# Altium schematic sheet Port.SchDoc
size A4; SheetNumber: 3; SheetTotal: 4
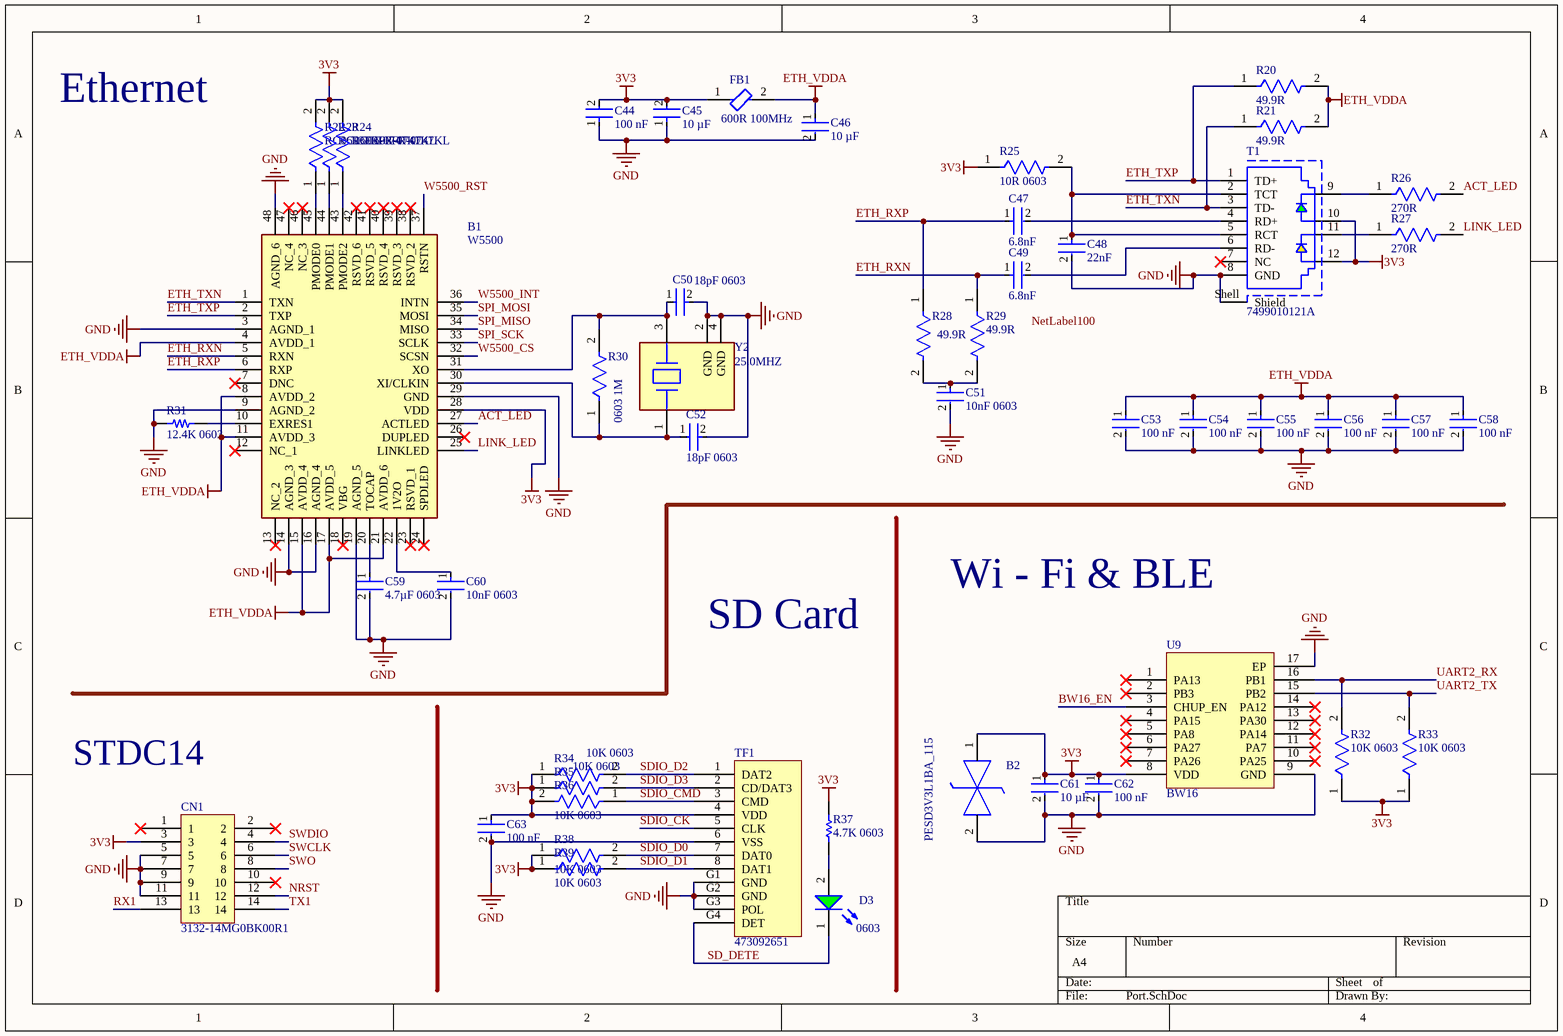
[diagram p0: Port.SchDoc]

## Parts
B1  W5500  [W5500]
B2  PESD3V3L1BA_115  [SOD2512X110N]
C44  100 nF  [FP-CL10-IPC_A]
C45  10 µF  [FP-CL10-IPC_C]
C46  10 µF  [FP-CL10-IPC_C]
C47  6.8nF  [FP-CC0603-DA-MFG]
C48  22nF  [FP-CC0603-DA-MFG]
C49  6.8nF  [FP-CC0603-DA-MFG]
C50  18pF 0603  [FP-C1608-080-0_1-IPC_C]
C51  10nF 0603  [FP-CC0603-DA-MFG]
C52  18pF 0603  [FP-C1608-080-0_1-IPC_C]
C53  100 nF  [FP-CL10-IPC_A]
C54  100 nF  [FP-CL10-IPC_A]
C55  100 nF  [FP-CL10-IPC_A]
C56  100 nF  [FP-CL10-IPC_A]
C57  100 nF  [FP-CL10-IPC_A]
C58  100 nF  [FP-CL10-IPC_A]
C59  4.7µF 0603  [FP-C0603-CG-MFG]
C60  10nF 0603  [FP-CC0603-DA-MFG]
C61  10 µF  [FP-CL10-IPC_C]
C62  100 nF  [FP-CL10-IPC_A]
C63  100 nF  [FP-CL10-IPC_A]
CN1  3132-14MG0BK00R1  [STDC14 Header]
D3  0603  [WL-SMCW_0603_150060xx75000]
FB1  600R 100MHz  [FP-BLM18-0_15-t0_8-MFG]
R20  49.9R  [FP-RT0603-MFG]
R21  49.9R  [FP-RT0603-MFG]
R22  RC0603FR-0747KL  [FP-RC0603FR-0747KL-MFG]
R23  RC0603FR-0747KL  [FP-RC0603FR-0747KL-MFG]
R24  RC0603FR-0747KL  [FP-RC0603FR-0747KL-MFG]
R25  10R 0603  [FP-RT0603-MFG]
R26  270R  [FP-RT0603-MFG]
R27  270R  [FP-RT0603-MFG]
R28  49.9R  [FP-RT0603-MFG]
R29  49.9R  [FP-RT0603-MFG]
R30  0603 1M  [FP-RC0603-0_55-IPC_C]
R31  12.4K 0603  [4.7R]
R32  10K 0603  [FP-RC0603-0_55-IPC_C]
R33  10K 0603  [FP-RC0603-0_55-IPC_C]
R34  10K 0603  [FP-RC0603-0_55-IPC_C]
R35  10K 0603  [FP-RC0603-0_55-IPC_C]
R36  10K 0603  [FP-RC0603-0_55-IPC_C]
R37  4.7K 0603  [RESC1608X55X25LL10T15]
R38  10K 0603  [FP-RC0603-0_55-IPC_C]
R39  10K 0603  [FP-RC0603-0_55-IPC_C]
T1  7499010121A  [7499010121A]
TF1  473092651  [TF-SMD_47309-2285]
U9  BW16  [BW16]
Y2  25.0MHZ  [FP-ABM8G-MFG]

## Nets
3V3: B1.28(VDD) B2.1(K1) C44.2 C45.2 C61.1 C62.1 C63.1 CN1.3 FB1.1 R22.2 R23.2 R24.2 R25.1 R32.1 R33.1 R34.1 R35.1 R36.2 R37.1 R38.1 R39.1 T1.10 T1.12 TF1.4(VDD) U9.8(VDD)
ETH_VDDA: B1.4(AVDD_1) B1.8(AVDD_2) B1.11(AVDD_3) B1.15(AVDD_4) B1.17(AVDD_5) B1.21(AVDD_6) C46.1 C53.1 C54.1 C55.1 C56.1 C57.1 C58.1 FB1.2 R20.2 R21.2
GND: B1.3(AGND_1) B1.9(AGND_2) B1.14(AGND_3) B1.16(AGND_4) B1.19(AGND_5) B1.29(GND) B1.48(AGND_6) B2.2(K2) C44.1 C45.1 C46.2 C48.2 C50.2 C51.2 C52.2 C53.2 C54.2 C55.2 C56.2 C57.2 C58.2 C59.2 C60.2 C61.2 C62.2 C63.2 CN1.5 CN1.7 CN1.9 CN1.11 R31.2 T1.8(GND) T1.Shell(Shield) TF1.6(VSS) TF1.G1(GND) TF1.G2(GND) TF1.G3(POL) U9.9(GND) U9.17(EP) Y2.2(GND) Y2.4(GND)
ACT_LED: B1.27(ACTLED) R26.2
BW16_EN: U9.3(CHUP_EN)
ETH_RXN: B1.5(RXN) C49.1 R29.1
ETH_RXP: B1.6(RXP) C47.1 R28.1
ETH_TXN: B1.1(TXN) R21.1 T1.3(TD-)
ETH_TXP: B1.2(TXP) R20.1 T1.1(TD+)
LINK_LED: B1.25(LINKLED) R27.2
NRST: CN1.12
RX1: CN1.13
SD_DETE: D3.1(K) TF1.G4(DET)
SDIO_CK: TF1.5(CLK)
SDIO_CMD: R36.1 TF1.3(CMD)
SDIO_D0: R38.2 TF1.7(DAT0)
SDIO_D1: R39.2 TF1.8(DAT1)
SDIO_D2: R34.2 TF1.1(DAT2)
SDIO_D3: R35.2 TF1.2(CD/DAT3)
SPI_MISO: B1.34(MISO)
SPI_MOSI: B1.35(MOSI)
SPI_SCK: B1.33(SCLK)
SWCLK: CN1.6
SWDIO: CN1.4
SWO: CN1.8
TX1: CN1.14
UART2_RX: R32.2 U9.16(PB1)
UART2_TX: R33.2 U9.15(PB2)
W5500_CS: B1.32(SCSN)
W5500_INT: B1.36(INTN)
W5500_RST: B1.37(RSTN)
NetB1_10: B1.10(EXRES1) R31.1
NetB1_20: B1.20(TOCAP) C59.1
NetB1_22: B1.22(1V2O) C60.1
NetB1_30: B1.30(XI/CLKIN) C52.1 R30.1 Y2.1
NetB1_31: B1.31(XO) C50.1 R30.2 Y2.3
NetB1_43: B1.43(PMODE2) R24.1
NetB1_44: B1.44(PMODE1) R23.1
NetB1_45: B1.45(PMODE0) R22.1
NetC47_2: C47.2 T1.4(RD+)
NetC48_1: C48.1 R25.2 T1.2(TCT) T1.5(RCT)
NetC49_2: C49.2 T1.6(RD-)
NetC51_1: C51.1 R28.2 R29.2
NetD3_2: D3.2(A) R37.2
NetR26_1: R26.1 T1.9
NetR27_1: R27.1 T1.11

Not connected (* = marked no-connect by the designer): B1 7(DNC)* 12(NC_1)* 13(NC_2)* 18(VBG)* 23(RSVD_1)* 24(SPDLED)* 26(DUPLED)* 38(RSVD_2)* 39(RSVD_3)* 40(RSVD_4)* 41(RSVD_5)* 42(RSVD_6)* 46(NC_3)* 47(NC_4)*; CN1 1* 2* 10*; T1 7(NC)*; U9 1(PA13)* 2(PB3)* 4(PA15)* 5(PA8)* 6(PA27)* 7(PA26)* 10(PA25)* 11(PA7)* 12(PA14)* 13(PA30)* 14(PA12)*

## Notes on the sheet
- Ethernet
- SD Card
- Wi - Fi & BLE
- STDC14
- Labels drawn without touching a wire or pin: NetLabel100

## Library data of the parts
B1 = W5500: Ethernet ICs 3in1 Enet Controller TCP/IP +MAC+PHY; Manufacturer_Name: WIZnet Inc; Geometry.Height: 1.6mm; Manufacturer_Part_Number: W5500; Mouser Part Number: 950-W5500; Mouser Price/Stock: https://www.mouser.co.uk/ProductDetail/WIZnet/W5500?qs=2vh%252B45pPFtzthUpYPd4pqA%3D%3D; Arrow Part Number: *; Arrow Price/Stock: *; Datasheet Link: http://wizwiki.net/wiki/lib/exe/fetch.php?media=products:w5500:w5500_ds_v106e_141230.pdf
B2 = PESD3V3L1BA_115: PESD3V3L1BA - Low capacitance bidirectional ESD protection diode in SOD323; Manufacturer_Name: Nexperia; Manufacturer_Part_Number: PESD3V3L1BA,115; Geometry.Height: 1.1mm; Mouser Part Number: 771-PESD3V3L1BA-T/R; Mouser Price/Stock: https://www.mouser.co.uk/ProductDetail/Nexperia/PESD3V3L1BA115?qs=LOCUfHb8d9tfcQwAsqvzKg%3D%3D; Arrow Part Number: PESD3V3L1BA,115; Arrow Price/Stock: https://www.arrow.com/en/products/pesd3v3l1ba115/nexperia?region=nac; Datasheet Link: https://assets.nexperia.com/documents/data-sheet/PESDXL1BA_SER.pdf
C44 C53-C58 C62 C63 = CMP-13271-004036-1: Cap Ceramic 100nF 100V X7R ±10% Pad SMD 0603 +125°C T/R; Mount: Surface Mount; Packaging: Cut Tape; Width: 0.031inch; Thickness: 0.035inch; Length: 0.063inch; Tolerance: 10%; Min Operating Temperature: -55°C; Case/Package: 0603; Voltage Rating: 100V; Max Operating Temperature: 125°C; Case Code (Metric): 1608; Capacitance: 100nF; Case Code (Imperial): 0603
C45 C46 C61 = CMP-13271-004224-1: Cap Ceramic 10uF 25V X5R ±20% Pad SMD 0603 +85°C T/R; Width: 0.031inch; Voltage Rating: 25V; Length: 0.063inch; Case Code (Metric): 1608; Dielectric: X5R; Termination: Wraparound; Capacitance: 10uF; Lead Free: Lead Free; Mount: Surface Mount; Package Quantity: 1; Case Code (Imperial): 0603; Thickness: 0.035inch; Packaging: Tape and Reel; Contact Plating: Tin; Min Operating Temperature: -55°C; Tolerance: 20%; Max Operating Temperature: 85°C; Case/Package: 0603
C47 C49 = CMP-03422-000576-1: CAP CER 6800PF 50V X7R 0603; Manufacturer Part Number: CC0603KRX7R9BB682; Manufacturer: YAGEO; Temperature Coefficient: 15%; Tolerance: 0.1; Material: Ceramic; Digikey Description: CAP CER 6800PF 50V X7R 0603; Footprint Url: http://www.yageo.com/exep/pages/download/literatures/UPY-C_GEN_24.pdf; Automotive: No; Octopart: https://octopart.com/cc0603krx7r9bb682-yageo-39467723; Lead Free: Yes; Temperature: -55°C to +125°C; RoHS: TRUE; Temperature Range High: +125°C; Package: CC0603-DA; Value: 6.8 nF; Height: 0.9mm; Temperature Range Low: -55°C; ComponentLink2Description: Datasheet; Category: Cap; Device Class L1: Passive Components; Device Class L2: Capacitors; Voltage: 50 V; Temperature Characteristic: X7R; Capacitance: 6.8 nF; Device Class L3: Ceramic Capacitors; Mouser Description: Multilayer Ceramic Capacitors MLCC - SMD/SMT 6.8nF 50V X7R 10%; Voltage Rating: 50 V; ComponentLink2URL: http://www.yageo.com/documents/recent/UPY-GPHC_X7R_6.3V-to-50V_18.pdf
C48 = CMP-2100-03602-3: CAP CER 0.022UF 50V X7R 0603; Dielectric Material: Ceramic; Insulation Resistance: 100GR; Tolerance: 10%; Thickness: 0.035inch; Case/Package: 0603; Packaging: Tape and Reel; Voltage Rating (DC): 50V; Length: 1.6mm; Depth: 0.8mm; Dielectric: X7R; Resistor Type: Ceramic; Min Operating Temperature: -55°C; Number of Pins: 2; Series: CC; Mount: Surface Mount; Max Operating Temperature: 125°C; Capacitance: 22nF; Case Code (Imperial): 0603; Width: 0.031inch; Halogen Free: Halogen Free; Lead Free: Lead Free; Voltage: 50V; RoHS Compliant: Yes; Package Quantity: 1; Height: 0.8mm; REACH SVHC: No SVHC; Voltage Rating: 50V; Case Code (Metric): 1608; Termination: SMD/SMT; Radiation Hardening: No
C50 C52 = CMP-08246-003585-1: Multilayer Ceramic Capacitors 18pF ±5% 50V C0G SMD 0603; Temperature Coefficient: 30ppm/°C; Height: 0.8mm; Packaging: Tape and Reel; Capacitance: 18pF; Min Operating Temperature: -55°C; Lead Free: Lead Free; Depth: 0.8mm; Length: 1.6mm; Voltage Rating: 50V; Weight: 7.1E-05oz; Radiation Hardening: No; Max Operating Temperature: 125°C; Voltage: 50V; Dielectric: C0G; Voltage Rating (DC): 50V; Case Code (Imperial): 0603; Number of Pins: 2; Mount: Surface Mount; Tolerance: 5%; Width: 0.031inch; RoHS Compliant: Yes; Series: C; Thickness: 0.037inch; Construction: Flat; Case Code (Metric): 1608; Case/Package: 0603; Package Quantity: 1; Dielectric Material: Ceramic; REACH SVHC: No SVHC; Termination: SMD/SMT
C51 C60 = CMP-2100-03600-2: CAP CER 10000PF 50V X7R 0603; Manufacturer Part Number: CC0603KRX7R9BB103; Manufacturer: YAGEO; Tolerance: 0.1; Material: Ceramic; Temperature Coefficient: 15%; Mouser Description: Multilayer Ceramic Capacitor, CC Series, 0.01 - F, - 10%, X7R, 50 V, 0603 [1608 Metric]; Digikey Description: CAP CER 10000PF 50V X7R 0603; Height: 0.9mm; Category: Cap; Temperature Characteristic: X7R; Footprint Url: http://www.yageo.com/exep/pages/download/literatures/UPY-C_GEN_24.pdf; Lead Free: Yes; Voltage Rating: 50 V; Temperature: -55°C to +125°C; Device Class L3: Ceramic Capacitors; ComponentLink2Description: Datasheet; Voltage: 50 V; Package: CC0603-DA; Octopart: https://octopart.com/cc0603krx7r9bb103-yageo-192938; Automotive: No; Temperature Range High: +125°C; Temperature Range Low: -55°C; Value: 10 nF; RoHS: TRUE; Device Class L1: Passive Components; ComponentLink2URL: http://www.yageo.com/documents/recent/UPY-GPHC_X7R_6.3V-to-50V_18.pdf; Device Class L2: Capacitors; Capacitance: 10 nF
C59 = CMP-2006-02256-2: CAP CER 4.7UF 6.3V X5R 0603; Manufacturer: Kemet; Manufacturer Part Number: C0603C475K9PACTU; Temperature Coefficient: 15%; Tolerance: 10%; Material: Ceramic; Device Class L3: Ceramic Capacitors; RoHS: TRUE; Value: 4.7uF; Lead Free: Yes; ComponentLink2Description: Datasheet; Mouser Description: Multilayer Ceramic Capacitors MLCC - SMD/SMT 6.3volts 4.7uF X5R 10%; Package: C0603-CG; Digikey Description: CAP CER 4.7UF 6.3V X5R 0603; ComponentLink2URL: https://content.kemet.com/datasheets/KEM_C1006_X5R_SMD.pdf; Category: Cap; Temperature Range Low: -55°C; Capacitance: 4.7uF; Temperature: -55°C to +85°C; Octopart: https://octopart.com/c0603c475k9pactu-kemet-104242; Ipc Land Pattern Name: CAPC16080X80; Voltage Rating: 6.3V; Temperature Range High: +85°C; Height: 0.9mm; Temperature Characteristic: X5R; Device Class L1: Passive Components; Automotive: No; Device Class L2: Capacitors
CN1 = STDC-14
D3 = CMP-1426-00002-3: NexarPartId: 29687084; Color: Green; Power Dissipation: 105mW; Peak Wavelength: 515nm; Viewing Angle: 140°; Test Current: 20mA; Wavelength: 520nm; Lens Style: Clear, Rectangular; Max Junction Temperature (Tj): 95°C; Luminous Intensity: 430mcd; Output Current: 10µA; Max Reverse Voltage (DC): 5V; Forward Voltage: 3.2V; Dominant Wavelength: 525nm; Forward Current: 100mA; Mount: Surface Mount; Height: 700µm; Lead Free: Lead Free; Min Operating Temperature: -40°C; Max Operating Temperature: 85°C; Length: 1.6mm; Width: 800µm; Case/Package: 0603; Case Code (Imperial): 0603; Case Code (Metric): 1608; Packaging: Tape and Reel; Reverse Voltage: 5V; REACH SVHC: Unknown; RoHS: Compliant
FB1 = CMP-0686-00436-3: Chip Ferrite Bead, 0603, 600Ω @ 100MHz, 0.38Ω, 25%, 500mA; Number of Lines: 1; DC Resistance (DCR): 380mR; Material: Steel; Shielding: Unshielded; Max DC Current: 500mA; Termination: SMD/SMT; Military Standard: Not; Number of Circuits: 1; Min Operating Temperature: -55°C; Case Code (Imperial): 0603; Width: 0.8mm; Current Rating: 500mA; Lead Free: Lead Free; Packaging: Tape and Reel; Frequency: 100MHz; Max Operating Temperature: 125°C; DC Current: 500mA; REACH SVHC: No SVHC; Case/Package: 0603; Package Quantity: 1; Height: 0.8mm; Number of Pins: 2; Impedance: 600R; Depth: 0.8mm; Test Frequency: 100MHz; Case Code (Metric): 1608; Tolerance: 25%; Core Material: Ferrite; Weight: 7.1E-05oz; Max Current Rating: 500mA; Radiation Hardening: No; Length: 1.6mm; RoHS Compliant: Yes
R20 R21 R28 R29 = CMP-03412-034007-1: RES SMD 49.9OHM 0.05% 1/10W 0603; Manufacturer: Yageo; Manufacturer Part Number: RT0603WRE0749R9L; Voltage Rating: 75V; Tolerance: 0.0005; Power Rating: 0.1W; Resistance: 49.9Ω; Temperature Coefficient: 50 ppm/°C; Value: 49.9Ω; RoHS: TRUE; Temperature Range Low: -55°C; Device Class L2: Resistors; Device Class L1: Passive Components; Footprint Url: http://www.yageo.com/exep/pages/download/literatures/PYu-R_Mount_10.pdf; Series: RT; Category: Res; Lead Free: Yes; Temperature: -55°C to +155°C; Octopart: https://octopart.com/rt0603wre0749r9l-yageo-71397127; Device Class L3: Chip SMD Resistors; Height: 0.55mm; Digikey Description: RES SMD 49.9OHM 0.05% 1/10W 0603; ComponentLink2Description: Datasheet; ComponentLink2URL: http://www.yageo.com/documents/recent/PYu-RT_1-to-0.01_RoHS_L_9.pdf; Automotive: No; Package: RT0603; Composition: Thin Film; Ipc Land Pattern Name: RESC16080X45; Temperature Range High: +155°C
R22-R24 = CMP-1659-00055-2: RES SMD 47K OHM 1% 1/10W 0603; Voltage Rating: 50V; Temperature Coefficient: 100ppm/°C; Max Power Dissipation: 100mW; Resistance: 47kR; Voltage Rating (DC): 50V; Min Operating Temperature: -55°C; Packaging: Tape and Reel; Features: Moisture Resistant; Termination: SMD/SMT; Technology: THICK FILM; Lead Free: Lead Free; Max Operating Temperature: 155°C; Width: 0.031inch; Case Code (Metric): 1608; Tolerance: 1%; Package Quantity: 1; Resistor Type: Thick Film; RoHS Compliant: Yes; Case/Package: 0603; Case Code (Imperial): 0603; Resistance Tolerance: 1%; Length: 0.063inch; Series: RC; Number of Pins: 2; Power Rating: 100mW; Number of Terminations: 2; Construction: Rectangular; Height: 0.022inch; Military Standard: Not; Size Code: 0603; Depth: 0.8mm
R25 = CMP-2000-04609-2: RES SMD 10 OHM 0.5% 1/10W 0603; Manufacturer: Yageo; Manufacturer Part Number: RT0603DRE0710RL; Voltage Rating: 75V; Tolerance: 0.005; Temperature Coefficient: 50 ppm/°C; Resistance: 10Ω; Power Rating: 0.1W; Value: 10Ω; Temperature Range Low: -55°C; RoHS: TRUE; Device Class L1: Passive Components; Footprint Url: http://www.yageo.com/exep/pages/download/literatures/PYu-R_Mount_10.pdf; Device Class L3: Chip SMD Resistors; Device Class L2: Resistors; Series: RT; ComponentLink2URL: http://www.yageo.com/documents/recent/PYu-RT_1-to-0.01_RoHS_L_9.pdf; Octopart: https://octopart.com/rt0603dre0710rl-yageo-1192091; Automotive: No; ComponentLink2Description: Datasheet; Ipc Land Pattern Name: RESC16080X45; Package: RT0603; Lead Free: Yes; Temperature: -55°C to +155°C; Category: Res; Height: 0.55mm; Temperature Range High: +155°C; Digikey Description: RES SMD 10 OHM 0.5% 1/10W 0603; Composition: Thin Film
R26 R27 = CMP-03412-020221-1: RES SMD 270 OHM 1% 1/10W 0603; Manufacturer: Yageo; Manufacturer Part Number: RT0603FRE07270RL; Voltage Rating: 75V; Resistance: 270Ω; Tolerance: 0.01; Power Rating: 0.1W; Temperature Coefficient: 50 ppm/°C; Value: 270Ω; Footprint Url: http://www.yageo.com/exep/pages/download/literatures/PYu-R_Mount_10.pdf; RoHS: TRUE; Automotive: No; Ipc Land Pattern Name: RESC16080X45; Series: RT; Temperature: -55°C to +155°C; Composition: Thin Film; Temperature Range Low: -55°C; Device Class L2: Resistors; Device Class L3: Chip SMD Resistors; Octopart: https://octopart.com/rt0603fre07270rl-yageo-40014674; Mouser Description: RT Series 0603 0.1 W 27 Ohm ±1 % ±50 ppm/°C SMT Thin Film Chip Resistor; Temperature Range High: +155°C; Height: 0.55mm; ComponentLink2URL: http://www.yageo.com/documents/recent/PYu-RT_1-to-0.01_RoHS_L_9.pdf; Package: RT0603; Device Class L1: Passive Components; Lead Free: Yes; Digikey Description: RES SMD 270 OHM 1% 1/10W 0603; ComponentLink2Description: Datasheet; Category: Res
R30 = CMP-2000-06953-2: RES SMD 1M OHM 5% 1/10W 0603; Voltage Rating (DC): 50V; Power Rating: 100mW; Temperature Coefficient: 100ppm/°C; Resistance: 1MR; Features: Moisture Resistant; Package Quantity: 5000; Case Code (Imperial): 0603; Packaging: Tape and Reel; Resistor Type: Thick Film; Number of Pins: 2; Size Code: 0603; Resistance Tolerance: 5%; Max Operating Temperature: 155°C; Voltage Rating: 50V; Depth: 0.8mm; Termination: SMD/SMT; Width: 0.8mm; RoHS Compliant: Yes; Number of Terminations: 2; Height: 0.45mm; Lead Free: Lead Free; Case/Package: 0603; Military Standard: Not; Min Operating Temperature: -55°C; Case Code (Metric): 1608; Radiation Hardening: No; Series: RC; Length: 1.6mm; Tolerance: 5%; REACH SVHC: No SVHC; Contact Plating: Tin; Construction: Rectangular; Max Power Dissipation: 100mW
R31 = 4.7R 0603: SMT Resistor
R32-R36 R38 R39 = CMP-2100-03664-2: RES 10K OHM 1% 1/10W 0603; Voltage Rating: 75V; Voltage Rating (DC): 50V; Resistance: 10kR; Power Rating: 100mW; Temperature Coefficient: 100ppm/°C; Depth: 0.8mm; Termination: SMD/SMT; Resistor Type: Thick Film; Series: RC; Construction: Rectangular; Features: Moisture Resistant; Packaging: Tape and Reel; Min Operating Temperature: -55°C; Number of Terminations: 2; Lead Pitch: 0.3mm; RoHS Compliant: Yes; Case/Package: 0603; Resistance Tolerance: 1%; Military Standard: Not; Weight: 7.1E-05oz; Number of Pins: 2; Tolerance: 1%; Length: 1.6mm; Case Code (Imperial): 0603; Lead Free: Lead Free; Width: 0.8mm; Max Power Dissipation: 100mW; Height: 0.45mm; Max Operating Temperature: 155°C; Case Code (Metric): 1608; Size Code: 0603
R37 = CMP-2000-06942-1: Chip Resistor, 4.7 KOhm, +/- 1%, 0.1 W, -55 to 155 degC, 0603 (1608 Metric), RoHS, Tape and Reel; Manufacturer: Yageo; Power Rating: 100mW; Temperature Coefficient: 100PPM/C; Resistance: 4.7kOhms; Voltage Rating: 50V; Package Reference: 0603; Series: RC; Datasheet Version: Rev. 7, 05/2017; Packaging: Reel; Termination Style: SMD/SMT; Datasheet URL: http://www.yageo.com/documents/recent/PYu-RC_Group_51_RoHS_L_7.pdf; Manufacturer URL: http://www.yageo.com/; Package Description: 2-Pin Surface Mount Device, Body 1.6 x 0.8 mm; Case Code - mm: 1608; Case Code - in: 0603; Mounting Technology: SurfaceMount; Operating Temperature Range: -55Cto+155C; Tolerance: 1%; Product: ThickFilmResistorsGeneralPurpose
T1 = CMP-03913-20254625-2: 7499010121A Telecom and Datacom Connector, 8 Contact(s), Right Angle, Solder Terminal; Number of Ports: 1; Number of Positions: 8; Shielding: Shielded; Pitch: 2.54mm; Insertion Loss (dB): -1dB; Inductance: 350µH; Number of Cores per Jack: 4; Color: Green, Silver, Yellow; Direction: Up; Connector Type: RJ45, Socket; Gender: Female; Min Operating Temperature: 0°C; Contact Plating: Gold; Case/Package: Metal; Number of Contacts: 8; REACH SVHC: No SVHC; Housing Material: Thermoplastic; NexarPartId: 20254625; Depth: 25.3mm; Max Operating Temperature: 70°C; Width: 16mm; Length: 25mm; Number of Rows: 1; Lead Free: Lead Free; RoHS: Compliant; Termination: Through Hole; Mount: PCB, Through Hole; Flammability Rating: UL94 V-0; Contact Material: Ferrite, Gold; Height: 14mm
TF1 = TF-SMD
Y2 = CMP-2000-05733-3: Crystal 25MHz ±20ppm (Tol) ±30ppm (Stability) 18pF FUND 60Ω 4-Pin SMD T/R; Series Resistance: 60R; Length: 3.2mm; Depth: 2.5mm; Packaging: Tape and Reel; Min Operating Temperature: -40°C; Operating Frequency: 25 MHz; Lead Free: Lead Free; Number of Pins: 4; Frequency Tolerance: 20ppm; Radiation Hardening: No; Max Operating Temperature: 85°C; Termination: SMD/SMT; Frequency Stability: 30ppm; Frequency: 25MHz; Series: ABM8G; Mount: Surface Mount; Package Quantity: 1000; Height: 0.039inch; Width: 0.098inch; Case/Package: CSMD; ESR (Equivalent Series Resistance): 60R; Load Capacitance: 18pF; Tolerance: 20ppm